# Altium schematic sheet 04_can.SchDoc: KART : CAN
size A4; DrawnBy: JNieto; DocumentNumber: 4; Revision: 1.0; SheetNumber: 5; SheetTotal: 10; Version: V 1.0.0
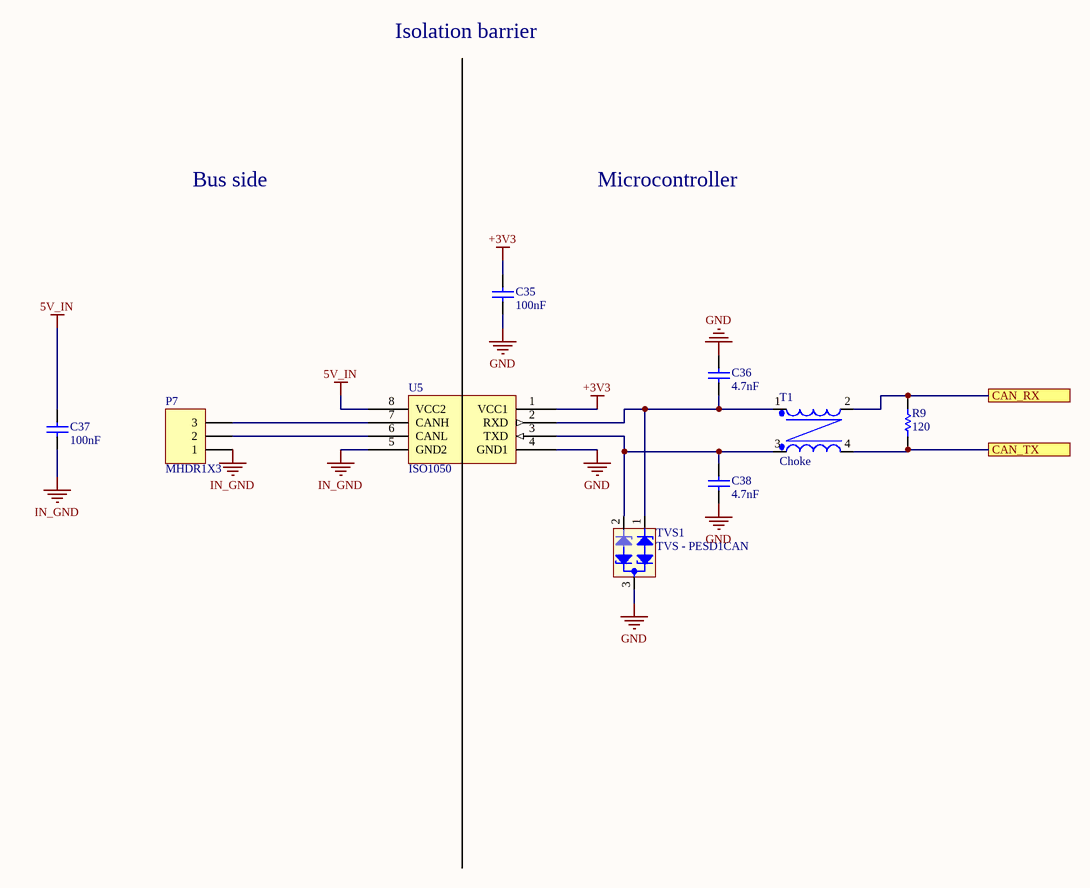
[diagram p0: 04_can.SchDoc]

## Parts
C35  value 100nF  [C0603]  (hidden comment: Capacitor)
C36  value 4.7nF  [C0603]  (hidden comment: Capacitor)
C37  value 100nF  [C0603]  (hidden comment: Capacitor)
C38  value 4.7nF  [C0603]  (hidden comment: Capacitor)
P7  MHDR1X3  [MHDR1X3]
R9  value 120  [R0603]
T1  Choke  [Choke 744232601 Wurth - Footprint Fabricante]
TVS1  TVS - PESD1CAN  [SOT23A]
U5  ISO1050  [ISO1050]

## Ports
CAN_RX, CAN_TX

## Nets
5V_IN: C37.2 U5.8(VCC2)
+3V3: C35.2 U5.1(VCC1)
GND: C35.1 C36.2 C38.1 TVS1.3(Common_Cathode) U5.4(GND1)
IN_GND: C37.1 P7.1 U5.5(GND2)
CAN_RX: R9.1 T1.2(Sec+) ; port CAN_RX
CAN_TX: R9.2 T1.4(Sec-) ; port CAN_TX
NetC36_1: C36.1 T1.1(Pri+) TVS1.1(Cathode) U5.2(RXD)
NetC38_2: C38.2 T1.3(Pri-) TVS1.2(Cathode) U5.3(TXD)
NetP7_2: P7.2 U5.6(CANL)
NetP7_3: P7.3 U5.7(CANH)

## Notes on the sheet
- Isolation barrier
- Bus side
- Microcontroller

## Library data of the parts
C35 C37 = MCD-00010: Capacitor, MLCC, 100nF, 16V, X5R, 10%, 0603, T=0,8mm; Manufacturer_Part_Number: CC0603KRX5R7BB105; Manufacturer: YAGEO; Provided_By: SUBCO; Internal_Part_Number: MCD-00010; Status: Released; Part_Type: Capacitor; Package: C0603; ComponentLink1Description: Datasheet; ComponentLink1URL: http://tunmcdsvn.tun.st.com/Component_Datasheet_Library/Trunk/Capacitors/Yageo_Multilayer_capacitor_X5R_series_100pF_to_100uF
C36 C38 = MCD-00102: Capacitor, MLCC, 4.7nF, 16V, X7R, 10%, 0402, T=0,5mm; Manufacturer_Part_Number: CC0402KRX7R7BB104; Manufacturer: YAGEO; Alternate_Manufacturer_Part_Number: GCM155R71C104KA55D; Alternate_Manufacturer: MURATA; Provided_By: SUBCO; Internal_Part_Number: MCD-00102; Status: Released; Part_Type: Capacitor; Package: C0402; ComponentLink1Description: Datasheet; ComponentLink1URL: http://tunmcdsvn.tun.st.com/Component_Datasheet_Library/Trunk/Capacitors/Yageo_Multilayer_Capacitor_X7R_series_100pF_to_22uF
P7 = MHDR1X3: Header, 3-Pin; LatestRevisionDate: 17-Jul-2002; LatestRevisionNote: Re-released for DXP Platform.; Publisher: Altium Limited
R9 = MCD-00220: Resistor,120,0603,1%,1/10W; Manufacturer_Part_Number: RC0603FR-0710KL; Manufacturer: YAGEO; Provided_By: Subcon; Initial_Board_Reference: MB1319; Internal_Part_Number: MCD-00220; Status: Released; Part_Type: Resistor; ComponentLink1Description: Datasheet; ECCN_US: n/a; ECCN_EU: n/a; Package: R0603; ComponentLink1URL: http://tunmcdsvn.tun.st.com/Component_Datasheet_Library/Trunk/Resistors/Yageo_Resistor_RC0603-series
T1 = Choke_1: Choke modo comun; Dist. 1: FARNELL; Dist. 1 Codigo: 1636477
TVS1 = TVS - PESD1CAN: CAN bus ESD protection diode; Dist. 1 Codigo: 1510703; Dist. 1: FARNELL
U5 = ISO1050: CAN Transceiver, Isolated, Vcc1 - 3 to 5V, Vcc2 - 5V; Precio: 4.09; Dist. 1: Farnell; Dist. 1 Codigo: 1755712; Codigo fabricante: ISO1050DUBR; Comentario: IC, CAN TRANSCEIVER, ISOLATED, 5V